# Altium project unextended_ISO.PrjPcb
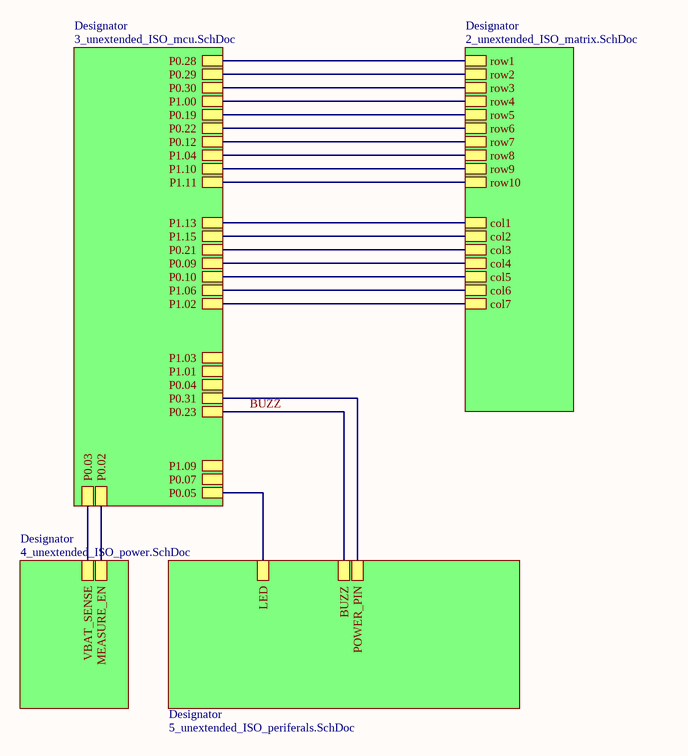
[diagram p0: 1_unextended_ISO_top.SchDoc]
ProjectTitle: cyber60 schematic; Revision: C2-ALPS
5 sheets, 179 parts. Net scope: hierarchical (ports join the sheet entries above them; power ports are global).
Board file: unextended_ISO.PcbDoc
Sheets:
  1_unextended_ISO_top.SchDoc
    Designator = 3_unextended_ISO_mcu.SchDoc
    Designator = 2_unextended_ISO_matrix.SchDoc
    Designator = 4_unextended_ISO_power.SchDoc
    Designator = 5_unextended_ISO_periferals.SchDoc

## Sheet 1_unextended_ISO_top.SchDoc: =ProjectTitle
size A4; Engineer: 4pplet; Address1: github.com/4pplet/cyber60; Address2: Licence: CERN-OHL-S; Revision: C2-ALPS; SheetNumber: 1; SheetTotal: 5; ProjectName: waffling60

### Sub-sheets
Designator = 3_unextended_ISO_mcu.SchDoc: P1.02, P1.04, P1.06, P0.12, P1.09, P1.11, P1.10, P0.07, P0.21, P0.23, P1.03, P1.00, P1.01, P0.22, P0.19, P0.10, P0.09, P0.31, P0.29, P1.13, P1.15, P0.05, P0.04, P0.02, P0.28, P0.30, P0.03
Designator = 2_unextended_ISO_matrix.SchDoc: col6, col5, col7, col3, col2, col1, col4, row3, row1, row4, row2, row5, row6, row9, row7, row8, row10
Designator = 4_unextended_ISO_power.SchDoc: VBAT_SENSE, MEASURE_EN
Designator = 5_unextended_ISO_periferals.SchDoc: POWER_PIN, BUZZ, LED

### Nets
BUZZ: sheet Designator/P0.23, sheet Designator/BUZZ
col1: sheet Designator/P1.13, sheet Designator/col1
col2: sheet Designator/P1.15, sheet Designator/col2
col3: sheet Designator/P0.21, sheet Designator/col3
col4: sheet Designator/P0.09, sheet Designator/col4
col5: sheet Designator/P0.10, sheet Designator/col5
col6: sheet Designator/P1.06, sheet Designator/col6
col7: sheet Designator/P1.02, sheet Designator/col7
P0.02: sheet Designator/P0.02, sheet Designator/MEASURE_EN
P0.03: sheet Designator/P0.03, sheet Designator/VBAT_SENSE
P0.05: sheet Designator/P0.05, sheet Designator/LED
P0.12: sheet Designator/P0.12, sheet Designator/row7
P0.19: sheet Designator/P0.19, sheet Designator/row5
P0.22: sheet Designator/P0.22, sheet Designator/row6
P0.28: sheet Designator/P0.28, sheet Designator/row1
P1.00: sheet Designator/P1.00, sheet Designator/row4
P1.04: sheet Designator/P1.04, sheet Designator/row8
P1.10: sheet Designator/P1.10, sheet Designator/row9
P1.11: sheet Designator/P1.11, sheet Designator/row10
row2: sheet Designator/P0.29, sheet Designator/row2
row3: sheet Designator/P0.30, sheet Designator/row3
NetU301_11: sheet Designator/P0.31, sheet Designator/POWER_PIN

### Notes on the sheet
- Title
- Size:
- Date:
- A4
- Number:
- Time:
- Revision:
- Sheet
- of
- File:

## Sheet 3_unextended_ISO_mcu.SchDoc: =ProjectTitle
size A4; Address1: github.com/4pplet/cyber60; Address2: Licence: CERN-OHL-S; Revision: C2-ALPS; SheetNumber: 3; SheetTotal: 5
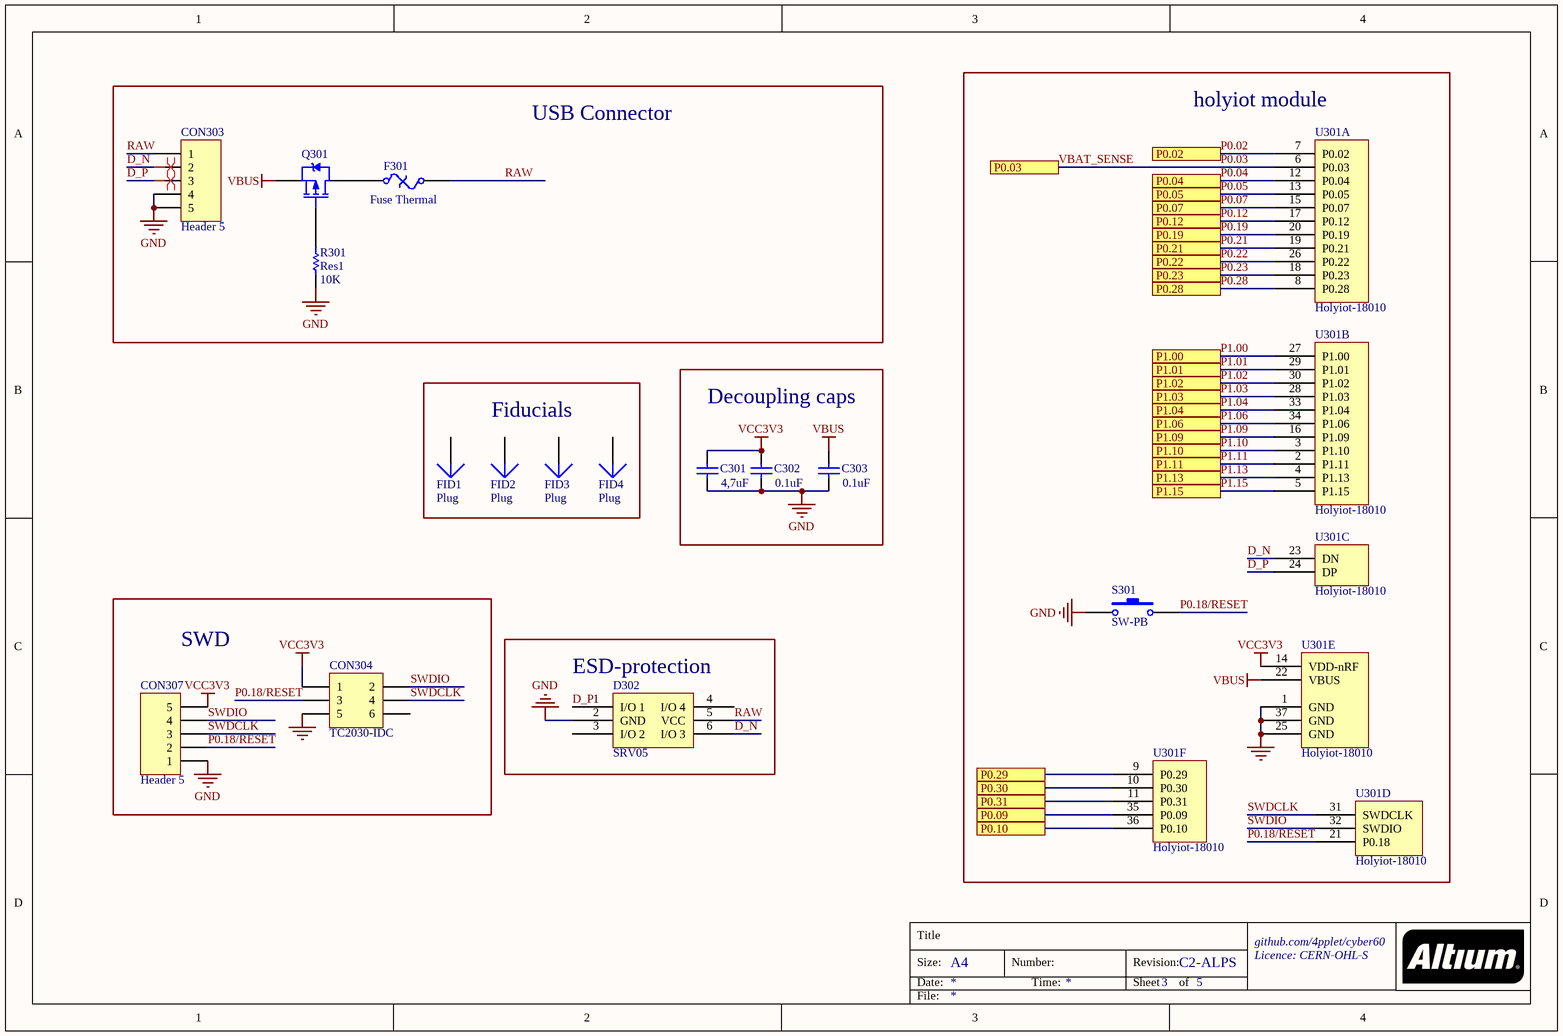
[diagram p1: 3_unextended_ISO_mcu.SchDoc]

### Parts
C301  value 4,7uF  [C0603[1608]]
C302  value 0.1uF  [C0603[1608]]
C303  value 0.1uF  [C0603[1608]]
CON303  Header 5  [JST SM04B-SRSS-TB]
CON304  TC2030-IDC  [TC2030-IDC-NL]  (no BOM)
CON307  Header 5  [HDR1X5]  (no BOM)
D302  SRV05  [SOT-23-6]
F301  Fuse Thermal  [C1206[3216]]
FID1  Plug  [Fiducial_Nordic]  (no BOM)
FID2  Plug  [Fiducial_Nordic]  (no BOM)
FID3  Plug  [Fiducial_Nordic]  (no BOM)
FID4  Plug  [Fiducial_Nordic]  (no BOM)
Q301  PMOS-2  [SOT-23-3]  (value not drawn)
R301  Res1  value 10K  [R0603[1608]]
S301  SW-PB  [XKB Switch]
U301  Holyiot-18010  [Holyiot-18010 - outer pads]  (parts A,B,C,D,E,F of 6)

### Blocks framed on the sheet
USB Connector: CON303 F301 Q301 R301
holyiot module: S301 U301
Fiducials: FID1-FID4
Decoupling caps: C301-C303
SWD: CON304 CON307
ESD-protection: D302

### Ports
P0.02, P0.03, P0.04, P0.05, P0.07, P0.09, P0.10, P0.12, P0.19, P0.21, P0.22, P0.23, P0.28, P0.29, P0.30, P0.31, P1.00, P1.01, P1.02, P1.03, P1.04, P1.06, P1.09, P1.10, P1.11, P1.13, P1.15

### Nets
GND: C301.1 C302.1 C303.1 CON303.4 CON303.5 CON304.5 CON307.1 D302.2(GND) R301.2 S301.1 U301.1(GND) U301.25(GND) U301.37(GND)
VBUS: C303.2 Q301.2(S) U301.22(VBUS)
VCC3V3: C301.2 C302.2 CON304.1 CON307.5 U301.14(VDD-nRF)
col4: U301.35(P0.09) ; port P0.09
col5: U301.36(P0.10) ; port P0.10
D_N: CON303.2 D302.6(I/O_3) U301.23(DN)
D_P: CON303.3 D302.1(I/O_1) U301.24(DP)
P0.02: U301.7(P0.02) ; port P0.02
P0.03: U301.6(P0.03) ; port P0.03  [also labelled VBAT_SENSE]
P0.04: U301.12(P0.04) ; port P0.04
P0.05: U301.13(P0.05) ; port P0.05
P0.07: U301.15(P0.07) ; port P0.07
P0.12: U301.17(P0.12) ; port P0.12
P0.18/RESET: CON304.3 CON307.2 S301.2 U301.21(P0.18)
P0.19: U301.20(P0.19) ; port P0.19
P0.21: U301.19(P0.21) ; port P0.21  [project net col3]
P0.22: U301.26(P0.22) ; port P0.22
P0.23: U301.18(P0.23) ; port P0.23  [project net BUZZ]
P0.28: U301.8(P0.28) ; port P0.28
P1.00: U301.27(P1.00) ; port P1.00
P1.01: U301.29(P1.01) ; port P1.01
P1.02: U301.30(P1.02) ; port P1.02  [project net col7]
P1.03: U301.28(P1.03) ; port P1.03
P1.04: U301.33(P1.04) ; port P1.04
P1.06: U301.34(P1.06) ; port P1.06  [project net col6]
P1.09: U301.16(P1.09) ; port P1.09
P1.10: U301.3(P1.10) ; port P1.10
P1.11: U301.2(P1.11) ; port P1.11
P1.13: U301.4(P1.13) ; port P1.13  [project net col1]
P1.15: U301.5(P1.15) ; port P1.15  [project net col2]
RAW: CON303.1 D302.5(VCC) F301.2
row2: U301.9(P0.29) ; port P0.29
row3: U301.10(P0.30) ; port P0.30
SWDCLK: CON304.4 CON307.3 U301.31(SWDCLK)
SWDIO: CON304.2 CON307.4 U301.32(SWDIO)
NetF301_1: F301.1 Q301.3(D)
NetQ301_1: Q301.1(G) R301.1
NetU301_11: U301.11(P0.31) ; port P0.31

Not connected (* = marked no-connect by the designer): CON304 6; D302 3(I/O_2) 4(I/O_4); FID1 1; FID2 1; FID3 1; FID4 1

### Layout directives
differential pair: D_N, D_P

### Notes on the sheet
- Title
- Size:
- Date:
- A4
- Number:
- Time:
- Revision:
- Sheet
- of
- File:

### Library data of the parts
C301 = Cap: Capacitor; MRF.Part: CL10A475KO8NNNC; LCSC MFG: Samsung Electro-Mechanics; LCSC Part #: C19666
C302 C303 = Cap: Capacitor; MRF.Part: CC0603KRX7R9BB104; MFG: KEMET; MFGPN: C0603C104M5RACTU; LCSC MFG: YAGEO; Version: 0603 imperial; LCSC Part #: C14663
CON303 = Header 5: JST for USB daughter board; MFGPN: SM04B-SRSS-TB(LF)(SN); MFG: JST Sales America Inc.; LCSC MFG: JST Sales America; LCSC Part #: C160404; MRF.Part: SM04B-SRSS-TB(LF)(SN)
CON304 = Header 3X2: Header, 3-Pin, Dual row
CON307 = Header 5: Header, 5-Pin
D302 = SRV05: MRF.Part: SRV05-4-P-T7; LCSC MFG: ProTek Devices; LCSC Part #: C85364
F301 = Fuse Thermal: Thermal Fuse; MRF.Part: ASMD1206-050; MFG: Bel Fuse Inc.; MFGPN: 0ZCJ0050FF2G; LCSC MFG: Shenzhen JDT Fuse; LCSC Part #: C135338
Q301 = PMOS-2: P-Channel Power MOSFET; MRF.Part: SI2301CDS-T1-GE3; LCSC MFG: Vishay Intertech; LCSC Part #: C10487; Version: SOT23-3
R301 = Res1: Resistor; MRF.Part: 0603WAF1002T5E; MFG: Panasonic Electronic Components; MFGPN: ERJ-3EKF5101V; LCSC MFG: Uniroyal Elec; Version: 0603 imperial; LCSC Part #: C25804
S301 = SW-PB: Switch; MRF.Part: TS-1187A-C-D-B; MFGPN: PTS645SM43SMTR92 LFS; MFG: C&K; LCSC MFG: XKB Enterprise; LCSC Part #: C318888
U301 = Holyiot-18010: MFGPN: 18010; MFG: HolyIOT

## Sheet 2_unextended_ISO_matrix.SchDoc: =ProjectTitle
size A3; Address1: github.com/4pplet/cyber60; Address2: Licence: CERN-OHL-S; Revision: C2-ALPS; SheetNumber: 2; SheetTotal: 5
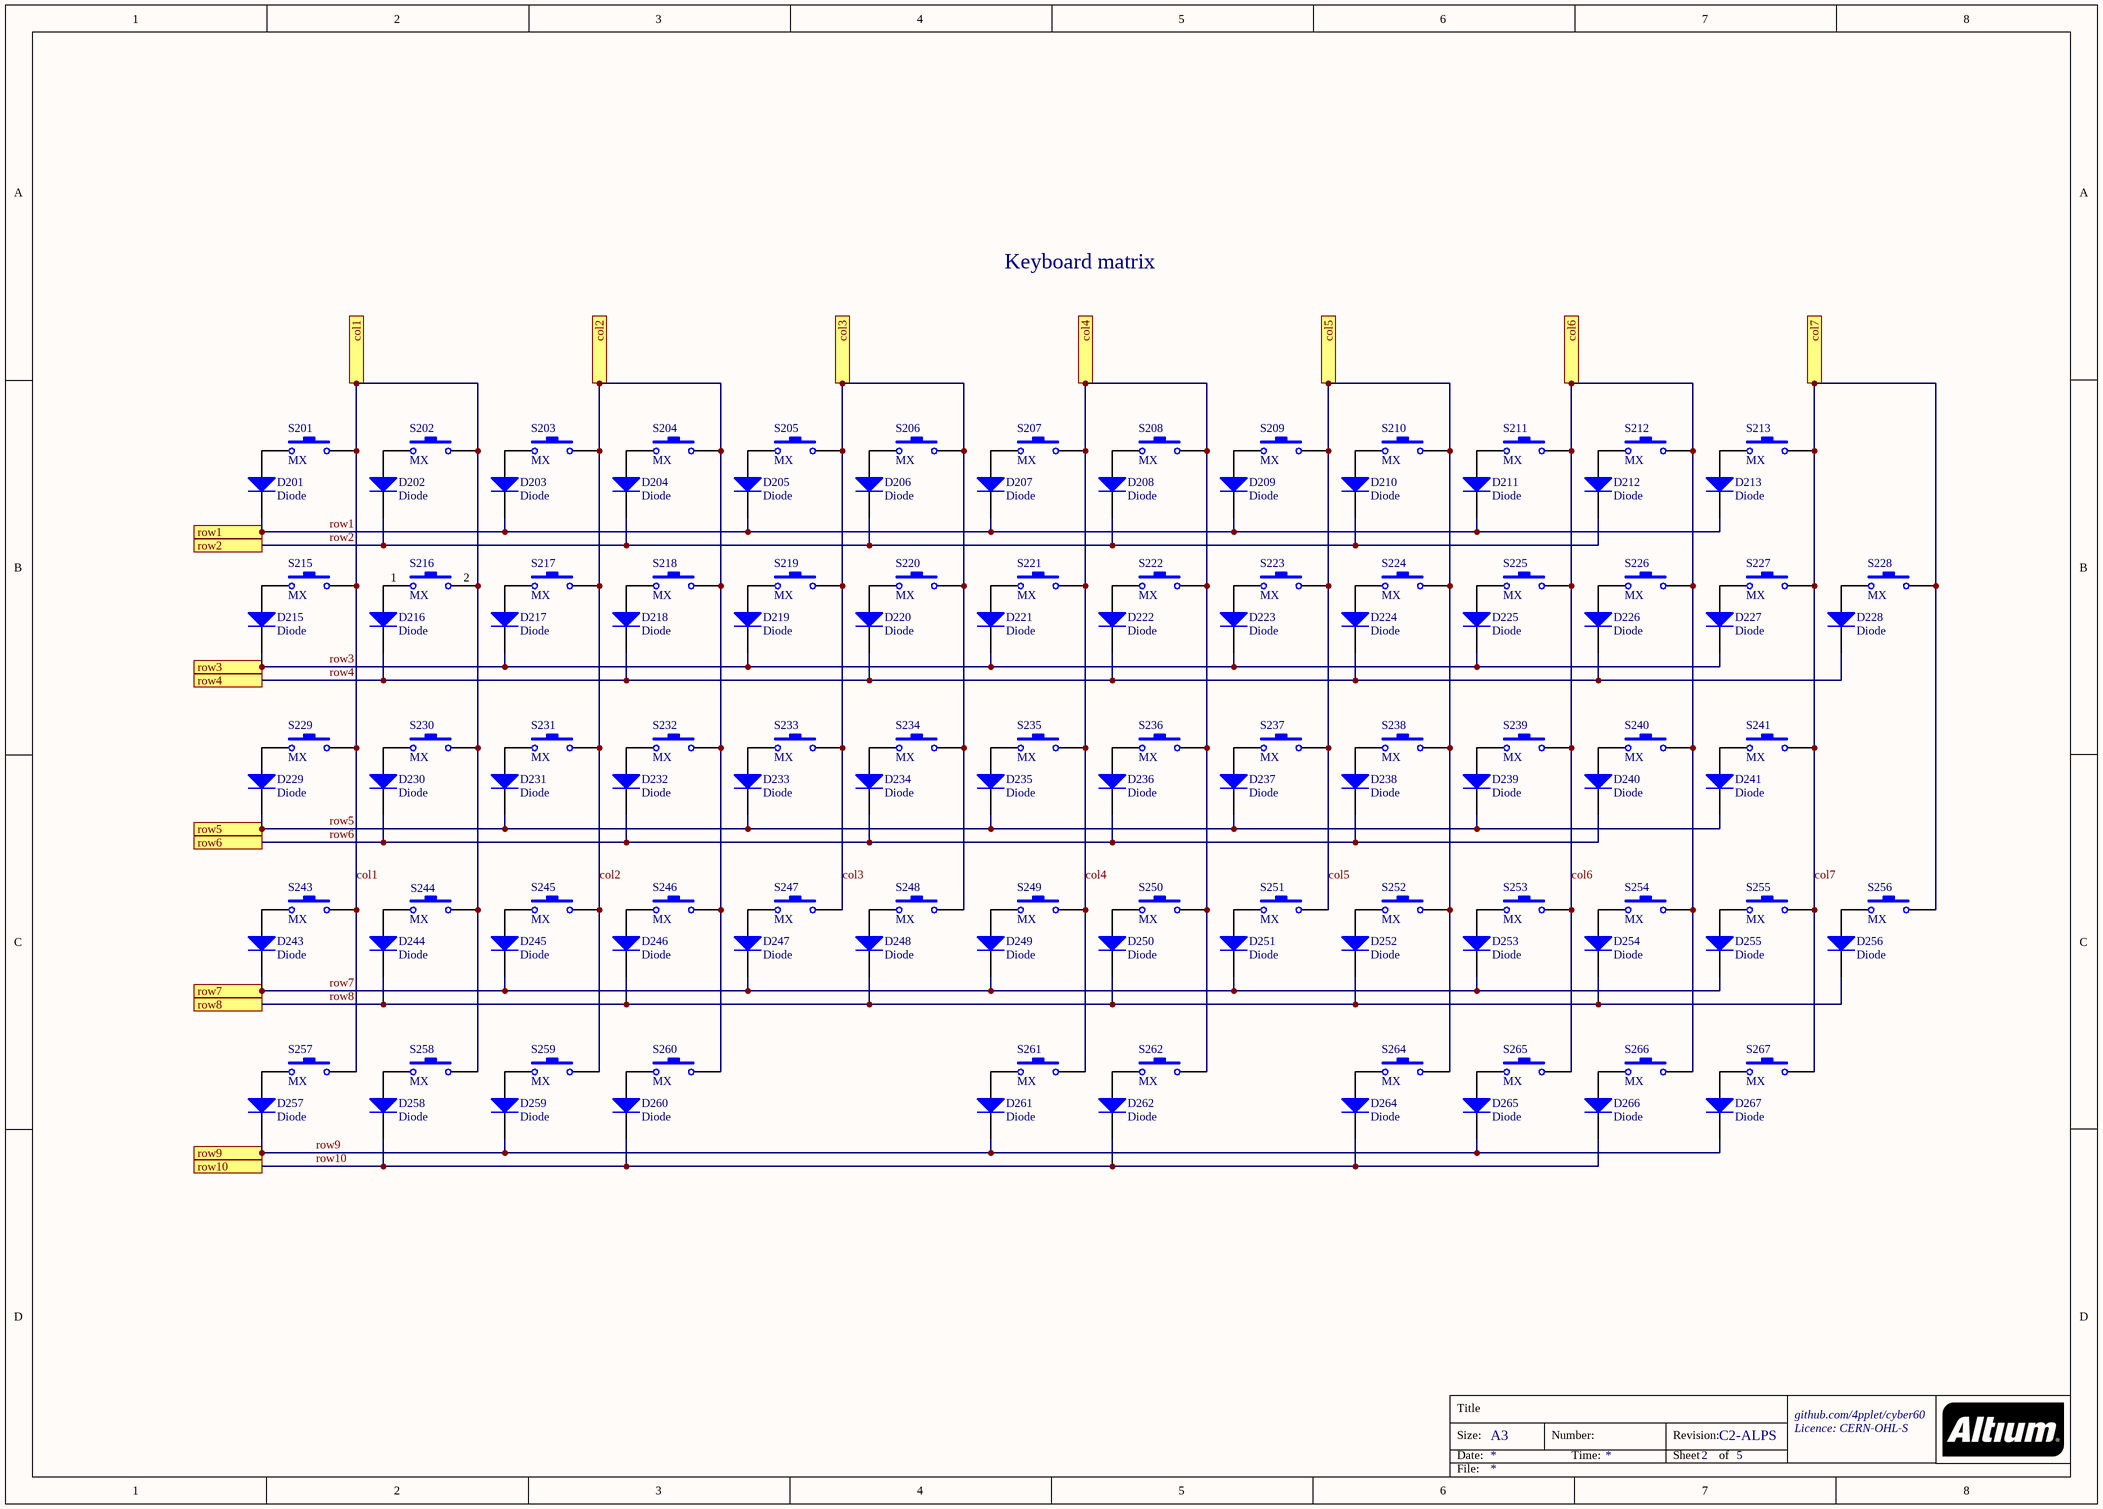
[diagram p2: 2_unextended_ISO_matrix.SchDoc]

### Parts
D201  Diode  [SOD-123]
D202  Diode  [SOD-123]
D203  Diode  [SOD-123]
D204  Diode  [SOD-123]
D205  Diode  [SOD-123]
D206  Diode  [SOD-123]
D207  Diode  [SOD-123]
D208  Diode  [SOD-123]
D209  Diode  [SOD-123]
D210  Diode  [SOD-123]
D211  Diode  [SOD-123]
D212  Diode  [SOD-123]
D213  Diode  [SOD-123]
D215  Diode  [SOD-123]
D216  Diode  [SOD-123]
D217  Diode  [SOD-123]
D218  Diode  [SOD-123]
D219  Diode  [SOD-123]
D220  Diode  [SOD-123]
D221  Diode  [SOD-123]
D222  Diode  [SOD-123]
D223  Diode  [SOD-123]
D224  Diode  [SOD-123]
D225  Diode  [SOD-123]
D226  Diode  [SOD-123]
D227  Diode  [SOD-123]
D228  Diode  [SOD-123]
D229  Diode  [SOD-123]
D230  Diode  [SOD-123]
D231  Diode  [SOD-123]
D232  Diode  [SOD-123]
D233  Diode  [SOD-123]
D234  Diode  [SOD-123]
D235  Diode  [SOD-123]
D236  Diode  [SOD-123]
D237  Diode  [SOD-123]
D238  Diode  [SOD-123]
D239  Diode  [SOD-123]
D240  Diode  [SOD-123]
D241  Diode  [SOD-123]
D243  Diode  [SOD-123]
D244  Diode  [SOD-123]
D245  Diode  [SOD-123]
D246  Diode  [SOD-123]
D247  Diode  [SOD-123]
D248  Diode  [SOD-123]
D249  Diode  [SOD-123]
D250  Diode  [SOD-123]
D251  Diode  [SOD-123]
D252  Diode  [SOD-123]
D253  Diode  [SOD-123]
D254  Diode  [SOD-123]
D255  Diode  [SOD-123]
D256  Diode  [SOD-123]
D257  Diode  [SOD-123]
D258  Diode  [SOD-123]
D259  Diode  [SOD-123]
D260  Diode  [SOD-123]
D261  Diode  [SOD-123]
D262  Diode  [SOD-123]
D264  Diode  [SOD-123]
D265  Diode  [SOD-123]
D266  Diode  [SOD-123]
D267  Diode  [SOD-123]
S201  MX  [Alps-switch - switched pol]  (no BOM)
S202  MX  [Alps-switch - switched pol]  (no BOM)
S203  MX  [Alps-switch - switched pol]  (no BOM)
S204  MX  [Alps-switch - switched pol]  (no BOM)
S205  MX  [Alps-switch - switched pol]  (no BOM)
S206  MX  [Alps-switch - switched pol]  (no BOM)
S207  MX  [Alps-switch - switched pol]  (no BOM)
S208  MX  [Alps-switch - switched pol]  (no BOM)
S209  MX  [Alps-switch - switched pol]  (no BOM)
S210  MX  [Alps-switch - switched pol]  (no BOM)
S211  MX  [Alps-switch - switched pol]  (no BOM)
S212  MX  [Alps-switch - switched pol]  (no BOM)
S213  MX  [Alps-switch]  (no BOM)
S215  MX  [Alps-switch - switched pol]  (no BOM)
S216  MX  [Alps-switch - switched pol]  (no BOM)
S217  MX  [Alps-switch - switched pol]  (no BOM)
S218  MX  [Alps-switch - switched pol]  (no BOM)
S219  MX  [Alps-switch - switched pol]  (no BOM)
S220  MX  [Alps-switch - switched pol]  (no BOM)
S221  MX  [Alps-switch - switched pol]  (no BOM)
S222  MX  [Alps-switch - switched pol]  (no BOM)
S223  MX  [Alps-switch - switched pol]  (no BOM)
S224  MX  [Alps-switch - switched pol]  (no BOM)
S225  MX  [Alps-switch - switched pol]  (no BOM)
S226  MX  [Alps-switch]  (no BOM)
S227  MX  [Alps-switch]  (no BOM)
S228  MX  [Alps-switch - switched pol]  (no BOM)
S229  MX  [Alps-switch]  (no BOM)
S230  MX  [Alps-switch - switched pol]  (no BOM)
S231  MX  [Alps-switch - switched pol]  (no BOM)
S232  MX  [Alps-switch - switched pol]  (no BOM)
S233  MX  [Alps-switch - switched pol]  (no BOM)
S234  MX  [Alps-switch - switched pol]  (no BOM)
S235  MX  [Alps-switch - switched pol]  (no BOM)
S236  MX  [Alps-switch - switched pol]  (no BOM)
S237  MX  [Alps-switch - switched pol]  (no BOM)
S238  MX  [Alps-switch - switched pol]  (no BOM)
S239  MX  [Alps-switch]  (no BOM)
S240  MX  [Alps-switch - switched pol]  (no BOM)
S241  MX  [Alps-switch - switched pol]  (no BOM)
S243  MX  [Alps-switch - switched pol]  (no BOM)
S244  MX  [Alps-switch - switched pol]  (no BOM)
S245  MX  [Alps-switch - switched pol]  (no BOM)
S246  MX  [Alps-switch - switched pol]  (no BOM)
S247  MX  [Alps-switch - switched pol]  (no BOM)
S248  MX  [Alps-switch - switched pol]  (no BOM)
S249  MX  [Alps-switch - switched pol]  (no BOM)
S250  MX  [Alps-switch - switched pol]  (no BOM)
S251  MX  [Alps-switch - switched pol]  (no BOM)
S252  MX  [Alps-switch - switched pol]  (no BOM)
S253  MX  [Alps-switch - switched pol]  (no BOM)
S254  MX  [Alps-switch - switched pol]  (no BOM)
S255  MX  [Alps-switch]  (no BOM)
S256  MX  [Alps-switch]  (no BOM)
S257  MX  [Alps-switch - switched pol]  (no BOM)
S258  MX  [Alps-switch]  (no BOM)
S259  MX  [Alps-switch]  (no BOM)
S260  MX  [Alps-switch]  (no BOM)
S261  MX  [Alps-switch - switched pol]  (no BOM)
S262  MX  [Alps-switch - switched pol]  (no BOM)
S264  MX  [Alps-switch]  (no BOM)
S265  MX  [Alps-switch]  (no BOM)
S266  MX  [Alps-switch]  (no BOM)
S267  MX  [ALPS-switch - AEKISO r_shift]  (no BOM)

### Ports
col1, col2, col3, col4, col5, col6, col7, row1, row2, row3, row4, row5, row6, row7, row8, row9, row10

### Nets
col1: S201.2 S202.2 S215.2 S216.2 S229.2 S230.2 S243.2 S244.2 S257.2 S258.2 ; port col1
col2: S203.2 S204.2 S217.2 S218.2 S231.2 S232.2 S245.2 S246.2 S259.2 S260.2 ; port col2
col3: S205.2 S206.2 S219.2 S220.2 S233.2 S234.2 S247.2 S248.2 ; port col3
col4: S207.2 S208.2 S221.2 S222.2 S235.2 S236.2 S249.2 S250.2 S261.1 S262.2 ; port col4
col5: S209.2 S210.2 S223.2 S224.2 S237.2 S238.2 S251.2 S252.2 S264.1 ; port col5
col6: S211.2 S212.2 S225.2 S226.2 S239.2 S240.2 S253.2 S254.2 S265.2 S266.2 ; port col6
col7: S213.2 S227.2 S228.1 S241.2 S255.2 S256.2 S267.1 ; port col7
row1: D201.2(K) D203.2(K) D205.2(K) D207.2(K) D209.2(K) D211.2(K) D213.2(K) ; port row1  [project net P0.28]
row2: D202.2(K) D204.2(K) D206.2(K) D208.2(K) D210.2(K) D212.2(K) ; port row2
row3: D215.2(K) D217.2(K) D219.2(K) D221.2(K) D223.2(K) D225.2(K) D227.2(K) ; port row3
row4: D216.2(K) D218.2(K) D220.2(K) D222.2(K) D224.2(K) D226.2(K) D228.2(K) ; port row4  [project net P1.00]
row5: D229.2(K) D231.2(K) D233.2(K) D235.2(K) D237.2(K) D239.2(K) D241.2(K) ; port row5  [project net P0.19]
row6: D230.2(K) D232.2(K) D234.2(K) D236.2(K) D238.2(K) D240.2(K) ; port row6  [project net P0.22]
row7: D243.2(K) D245.2(K) D247.2(K) D249.2(K) D251.2(K) D253.2(K) D255.2(K) ; port row7  [project net P0.12]
row8: D244.2(K) D246.2(K) D248.2(K) D250.2(K) D252.2(K) D254.2(K) D256.2(K) ; port row8  [project net P1.04]
row9: D257.2(K) D259.2(K) D261.2(K) D265.2(K) D267.2(K) ; port row9  [project net P1.10]
row10: D258.2(K) D260.2(K) D262.2(K) D264.2(K) D266.2(K) ; port row10  [project net P1.11]
NetD201_1: D201.1(A) S201.1
NetD202_1: D202.1(A) S202.1
NetD203_1: D203.1(A) S203.1
NetD204_1: D204.1(A) S204.1
NetD205_1: D205.1(A) S205.1
NetD206_1: D206.1(A) S206.1
NetD207_1: D207.1(A) S207.1
NetD208_1: D208.1(A) S208.1
NetD209_1: D209.1(A) S209.1
NetD210_1: D210.1(A) S210.1
NetD211_1: D211.1(A) S211.1
NetD212_1: D212.1(A) S212.1
NetD213_1: D213.1(A) S213.1
NetD215_1: D215.1(A) S215.1
NetD216_1: D216.1(A) S216.1
NetD217_1: D217.1(A) S217.1
NetD218_1: D218.1(A) S218.1
NetD219_1: D219.1(A) S219.1
NetD220_1: D220.1(A) S220.1
NetD221_1: D221.1(A) S221.1
NetD222_1: D222.1(A) S222.1
NetD223_1: D223.1(A) S223.1
NetD224_1: D224.1(A) S224.1
NetD225_1: D225.1(A) S225.1
NetD226_1: D226.1(A) S226.1
NetD227_1: D227.1(A) S227.1
NetD228_1: D228.1(A) S228.2
NetD229_1: D229.1(A) S229.1
NetD230_1: D230.1(A) S230.1
NetD231_1: D231.1(A) S231.1
NetD232_1: D232.1(A) S232.1
NetD233_1: D233.1(A) S233.1
NetD234_1: D234.1(A) S234.1
NetD235_1: D235.1(A) S235.1
NetD236_1: D236.1(A) S236.1
NetD237_1: D237.1(A) S237.1
NetD238_1: D238.1(A) S238.1
NetD239_1: D239.1(A) S239.1
NetD240_1: D240.1(A) S240.1
NetD241_1: D241.1(A) S241.1
NetD243_1: D243.1(A) S243.1
NetD244_1: D244.1(A) S244.1
NetD245_1: D245.1(A) S245.1
NetD246_1: D246.1(A) S246.1
NetD247_1: D247.1(A) S247.1
NetD248_1: D248.1(A) S248.1
NetD249_1: D249.1(A) S249.1
NetD250_1: D250.1(A) S250.1
NetD251_1: D251.1(A) S251.1
NetD252_1: D252.1(A) S252.1
NetD253_1: D253.1(A) S253.1
NetD254_1: D254.1(A) S254.1
NetD255_1: D255.1(A) S255.1
NetD256_1: D256.1(A) S256.1
NetD257_1: D257.1(A) S257.1
NetD258_1: D258.1(A) S258.1
NetD259_1: D259.1(A) S259.1
NetD260_1: D260.1(A) S260.1
NetD261_1: D261.1(A) S261.2
NetD262_1: D262.1(A) S262.1
NetD264_1: D264.1(A) S264.2
NetD265_1: D265.1(A) S265.1
NetD266_1: D266.1(A) S266.1
NetD267_1: D267.1(A) S267.2

### Notes on the sheet
- Keyboard matrix
- Title
- Size:
- Date:
- A3
- Number:
- Time:
- Revision:
- Sheet
- of
- File:

### Library data of the parts
D201-D213 D215-D241 D243-D262 D264-D267 = Diode: Default Diode; MRF.Part: 1N4148W; LCSC MFG: ST(Semtech); Version: SOD-123; LCSC Part #: C81598
S201-S213 S216-S241 S243-S262 S264-S267 = SW-PB: Switch
S215 = SW-PB: TAB

## Sheet 4_unextended_ISO_power.SchDoc: =ProjectTitle
size A4; Address1: github.com/4pplet/cyber60; Address2: Licence: CERN-OHL-S; Revision: C2-ALPS; SheetNumber: 4; SheetTotal: 5; ProjectName: unextended_ISO.PrjPcb
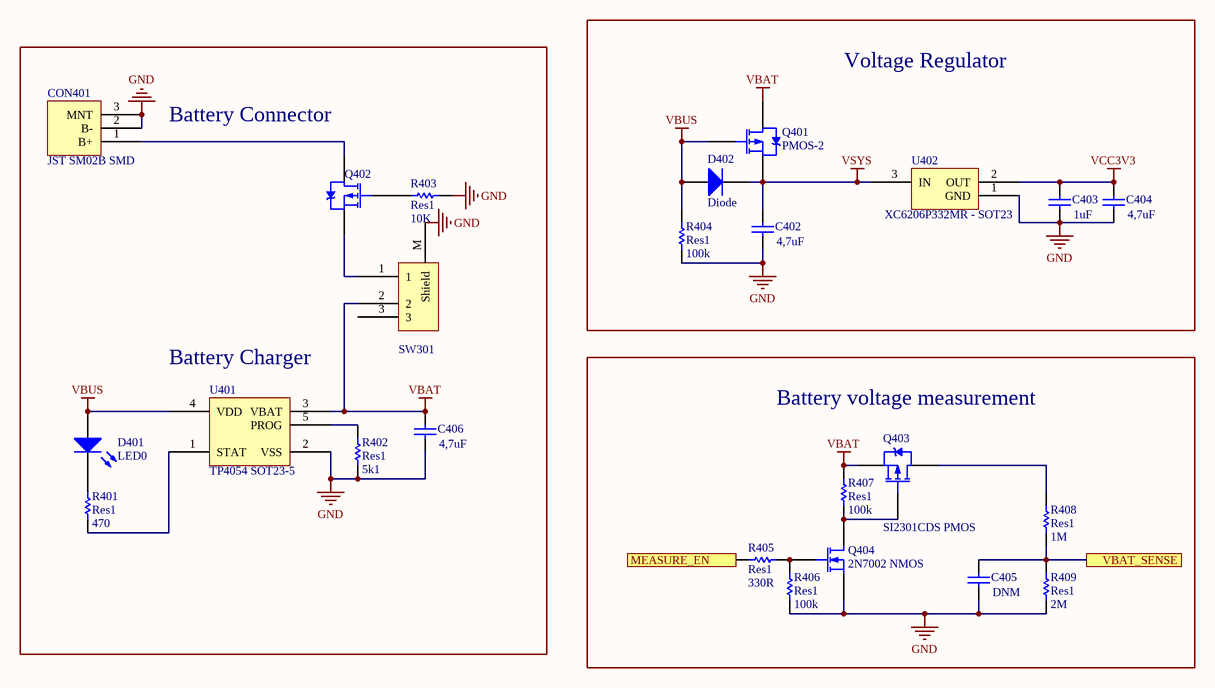
[diagram p3: 4_unextended_ISO_power.SchDoc]

### Parts
C402  value 4,7uF  [C0603[1608]]
C403  value 1uF  [C0603[1608]]
C404  value 4,7uF  [C0603[1608]]
C405  DNM  [C0603[1608]]  (no BOM)
C406  value 4,7uF  [C0603[1608]]
CON401  JST SM02B SMD  [JST S2B-PH-SM4-TB]
D401  LED0  [LED0603[1608]]
D402  Diode  [SOD-123]
Q401  PMOS-2  [SOT-23-3]
Q402  PMOS-2  [SOT-23-3]  (value not drawn)
Q403  SI2301CDS PMOS  [SOT-23-3]
Q404  2N7002 NMOS  [SOT-23-3]
R401  Res1  value 470  [R0603[1608]]
R402  Res1  value 5k1  [R0603[1608]]
R403  Res1  value 10K  [R0603[1608]]
R404  Res1  value 100k  [R0603[1608]]
R405  Res1  value 330R  [R0603[1608]]
R406  Res1  value 100k  [R0603[1608]]
R407  Res1  value 100k  [R0603[1608]]
R408  Res1  value 1M  [R0603[1608]]
R409  Res1  value 2M  [R0603[1608]]
SW301  Korean Hroparts Elec K3-1296S-E2  [Korean Hroparts Elec K3-1296S-E2]  (value not drawn)
U401  TP4054 SOT23-5  [SOT-23-5]
U402  XC6206P332MR - SOT23  [SOT-23-3]

### Blocks framed on the sheet
Voltage Regulator: C402-C404 D402 Q401 R404 U402
Battery voltage measurement: C405 Q403 Q404 R405-R409

### Ports
MEASURE_EN, VBAT_SENSE

### Nets
GND: C402.1 C403.1 C404.1 C405.1 C406.1 CON401.2(B-) CON401.3(MNT) Q404.2(S) R402.2 R403.2 R404.2 R406.2 R409.2 SW301.M(Shield) U401.2(VSS) U402.1(GND)
VBAT: C406.2 Q401.3(D) Q403.2(S) R407.1 SW301.2 U401.3(VBAT)
VBUS: D401.1(A) D402.1(A) Q401.1(G) R404.1 U401.4(VDD)
VCC3V3: C403.2 C404.2 U402.2(OUT)
VSYS: C402.2 D402.2(K) Q401.2(S) U402.3(IN)
P0.02: R405.1 ; port MEASURE_EN
P0.03: C405.2 R408.2 R409.1 ; port VBAT_SENSE
NetCON401_1: CON401.1(B+) Q402.3(D)
NetD401_2: D401.2(K) R401.2
NetQ402_1: Q402.1(G) R403.1
NetQ402_2: Q402.2(S) SW301.1
NetQ403_1: Q403.1(G) Q404.3(D) R407.2
NetQ403_3: Q403.3(D) R408.1
NetQ404_1: Q404.1(G) R405.2 R406.1
NetR401_1: R401.1 U401.1(STAT)
NetR402_1: R402.1 U401.5(PROG)

Not connected (* = marked no-connect by the designer): SW301 3

### Notes on the sheet
- Battery Connector
- (near U401) Battery Charger
- Title
- Size:
- Date:
- A4
- Number:
- Time:
- Revision:
- Sheet
- of
- File:

### Library data of the parts
C402 C404 C406 = Cap: as C301 on sheet 3_unextended_ISO_mcu; LCSC Part #: C19666
C403 = Cap: Capacitor; MRF.Part: CL10A105KB8NNNC; MFG: KEMET; MFGPN: C0603C104M5RACTU; LCSC MFG: Samsung Electro-Mechanics; Version: 0603 imperial; LCSC Part #: C15849
C405 = Cap: Capacitor; Value: DNM; Version: 0603 imperial
CON401 = JST S2B-PH-SM4-TB: LCSC MFG: JST Sales America
D401 = LED0: Typical INFRARED GaAs LED; MRF.Part: 19-213/Y2C-CQ2R2L/3T(CY); LCSC MFG: Everlight Elec; LCSC Part #: C72038
D402 = Diode: Default Diode; MRF.Part: B5819W; LCSC MFG: Changjiang Electronics Tech (CJ); Version: SOD-123; LCSC Part #: C8598
Q401 Q403 = PMOS-2: P-Channel Power MOSFET; MRF.Part: SI2301CDS-T1-GE3; Note: Pin 4 not drawn and electrically connected to Pin 2.; LCSC MFG: Vishay Intertech; LCSC Part #: C10487
Q402 = PMOS-2: as Q301 on sheet 3_unextended_ISO_mcu; LCSC Part #: C10487; Version: SOT23-3
Q404 = MOSFET-N: N-Channel MOSFET; LCSC MFG: Changjiang Electronics Tech (CJ); LCSC Part #: C8545; MRF.Part: 2N7002
R401 = Res1: Resistor; MRF.Part: 0603WAF4700T5E; MFG: Panasonic Electronic Components; MFGPN: ERJ-3EKF5101V; LCSC MFG: UNI-ROYAL(Uniroyal Elec); Version: 0603 imperial; LCSC Part #: C23179
R402 = Res1: Resistor; MRF.Part: 0603WAF5101T5E; MFG: Panasonic Electronic Components; MFGPN: ERJ-3EKF5101V; LCSC MFG: Uniroyal Elec; Version: 0603 imperial; LCSC Part #: C23186
R403 = Res1: as R301 on sheet 3_unextended_ISO_mcu; Version: 0603 imperial; LCSC Part #: C25804
R404 R406 R407 = Res1: Resistor; MRF.Part: 0603WAF1003T5E; LCSC MFG: Uniroyal Elec; Version: 0603 imperial; LCSC Part #: C25803
R405 = Res1: Resistor; MRF.Part: 0603WAF3300T5E; LCSC MFG: Uniroyal Elec; Version: 0603 imperial; LCSC Part #: C23138
R408 = Res1: Resistor; MRF.Part: 0603WAF1004T5E; LCSC MFG: Uniroyal Elec; Version: 0603 imperial; LCSC Part #: C22935
R409 = Res1: Resistor; MRF.Part: 0603WAF2004T5E; LCSC MFG: Uniroyal Elec; Version: 0603 imperial; LCSC Part #: C22976
U401 = MCP73831: LCSC MFG: Nanjing Extension Microelectronics; LCSC Part #: C32574; MRF.Part: TP4054
U402 = SOT23 LDO: LCSC MFG: Torex Semicon; MFG: Texas Instruments; MFGPN: TPS7A0533PDBZ; LCSC Part #: C5446; MRF.Part: XC6206P332MR
SW301 = Korean Hroparts Elec K3-1296S-E2: LCSC MFG: Korean Hroparts Elec; LCSC Part #: C136659; MFGPN: K3-1296S-E2

## Sheet 5_unextended_ISO_periferals.SchDoc: =ProjectTitle
size A4; Address1: github.com/4pplet/cyber60; Address2: Licence: CERN-OHL-S; Revision: C2-ALPS; SheetNumber: 5; SheetTotal: 5
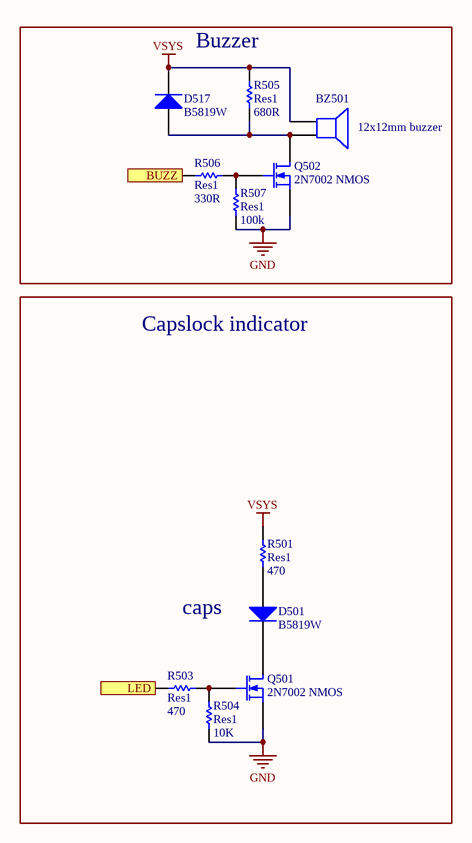
[diagram p4: 5_unextended_ISO_periferals.SchDoc]

### Parts
BZ501  12x12mm buzzer  [buzzer 12x12]
D501  B5819W  [MX-switch - CAPS - LED NO SWITCH]
D517  B5819W  [SOD-123]
Q501  2N7002 NMOS  [SOT-23-3]
Q502  2N7002 NMOS  [SOT-23-3]
R501  Res1  value 470  [R0603[1608]]
R503  Res1  value 470  [R0603[1608]]
R504  Res1  value 10K  [R0603[1608]]
R505  Res1  value 680R  [R0603[1608]]
R506  Res1  value 330R  [R0603[1608]]
R507  Res1  value 100k  [R0603[1608]]

### Blocks framed on the sheet
Buzzer: BZ501 D517 Q502 R505-R507

### Ports
BUZZ, LED

### Nets
GND: Q501.2(S) Q502.2(S) R504.2 R507.2
VSYS: BZ501.1 D517.2(K) R501.2 R505.1
BUZZ: R506.2 ; port BUZZ
P0.05: R503.1 ; port LED
NetBZ501_2: BZ501.2 D517.1(A) Q502.3(D) R505.2
NetD501_1: D501.1(A) R501.1
NetD501_2: D501.2(K) Q501.3(D)
NetQ501_1: Q501.1(G) R503.2 R504.1
NetQ502_1: Q502.1(G) R506.1 R507.1

### Notes on the sheet
- Capslock indicator
- caps
- Title
- Size:
- Date:
- A4
- Number:
- Time:
- Revision:
- Sheet
- of
- File:

### Library data of the parts
BZ501 = Speaker: Loudspeaker; MRF.Part: YS-SBZ1230; LCSC MFG: Fengming; LCSC Part #: C409829
D501 = Diode: Default Diode
D517 = Diode: Default Diode; LCSC MFG: Changjiang Electronics Tech (CJ); Version: SOD-123; LCSC Part #: C8598; MRF.Part: B5819W
Q501 Q502 = MOSFET-N: as Q404 on sheet 4_unextended_ISO_power; LCSC Part #: C8545; MRF.Part: 2N7002
R501 R503 = Res1: as R401 on sheet 4_unextended_ISO_power; Version: 0603 imperial; LCSC Part #: C23179
R504 = Res1: as R301 on sheet 3_unextended_ISO_mcu; Version: 0603 imperial; LCSC Part #: C25804
R505 = Res1: Resistor; MRF.Part: 0603WAF6800T5E; LCSC MFG: Uniroyal Elec; Version: 0603 imperial; LCSC Part #: C23228
R506 = Res1: as R405 on sheet 4_unextended_ISO_power; Version: 0603 imperial; LCSC Part #: C23138
R507 = Res1: as R404 on sheet 4_unextended_ISO_power; Version: 0603 imperial; LCSC Part #: C25803

## Nets that join several sheets
GND: 3_unextended_ISO_mcu (13 pins), 4_unextended_ISO_power (16 pins), 5_unextended_ISO_periferals (Q501.2 Q502.2 R504.2 R507.2)
VBUS: 3_unextended_ISO_mcu (C303.2 Q301.2 U301.22), 4_unextended_ISO_power (5 pins)
VCC3V3: 3_unextended_ISO_mcu (5 pins), 4_unextended_ISO_power (C403.2 C404.2 U402.2)
VSYS: 4_unextended_ISO_power (C402.2 D402.2 Q401.2 U402.3), 5_unextended_ISO_periferals (BZ501.1 D517.2 R501.2 R505.1)
BUZZ: 3_unextended_ISO_mcu (U301.18), 5_unextended_ISO_periferals (R506.2)
col1: 3_unextended_ISO_mcu (U301.4), 2_unextended_ISO_matrix (10 pins)
col2: 3_unextended_ISO_mcu (U301.5), 2_unextended_ISO_matrix (10 pins)
col3: 3_unextended_ISO_mcu (U301.19), 2_unextended_ISO_matrix (8 pins)
col4: 3_unextended_ISO_mcu (U301.35), 2_unextended_ISO_matrix (10 pins)
col5: 3_unextended_ISO_mcu (U301.36), 2_unextended_ISO_matrix (9 pins)
col6: 3_unextended_ISO_mcu (U301.34), 2_unextended_ISO_matrix (10 pins)
col7: 3_unextended_ISO_mcu (U301.30), 2_unextended_ISO_matrix (7 pins)
P0.02: 3_unextended_ISO_mcu (U301.7), 4_unextended_ISO_power (R405.1)
P0.03: 3_unextended_ISO_mcu (U301.6), 4_unextended_ISO_power (C405.2 R408.2 R409.1)
P0.05: 3_unextended_ISO_mcu (U301.13), 5_unextended_ISO_periferals (R503.1)
P0.12: 3_unextended_ISO_mcu (U301.17), 2_unextended_ISO_matrix (7 pins)
P0.19: 3_unextended_ISO_mcu (U301.20), 2_unextended_ISO_matrix (7 pins)
P0.22: 3_unextended_ISO_mcu (U301.26), 2_unextended_ISO_matrix (6 pins)
P0.28: 3_unextended_ISO_mcu (U301.8), 2_unextended_ISO_matrix (7 pins)
P1.00: 3_unextended_ISO_mcu (U301.27), 2_unextended_ISO_matrix (7 pins)
P1.04: 3_unextended_ISO_mcu (U301.33), 2_unextended_ISO_matrix (7 pins)
P1.10: 3_unextended_ISO_mcu (U301.3), 2_unextended_ISO_matrix (5 pins)
P1.11: 3_unextended_ISO_mcu (U301.2), 2_unextended_ISO_matrix (5 pins)
row2: 3_unextended_ISO_mcu (U301.9), 2_unextended_ISO_matrix (6 pins)
row3: 3_unextended_ISO_mcu (U301.10), 2_unextended_ISO_matrix (7 pins)